# Altium schematic sheet Accelerometer.SchDoc: Accelerometer
size A; Author: Micheal Burin; Revision: 1.0; SheetNumber: 8; SheetTotal: 10
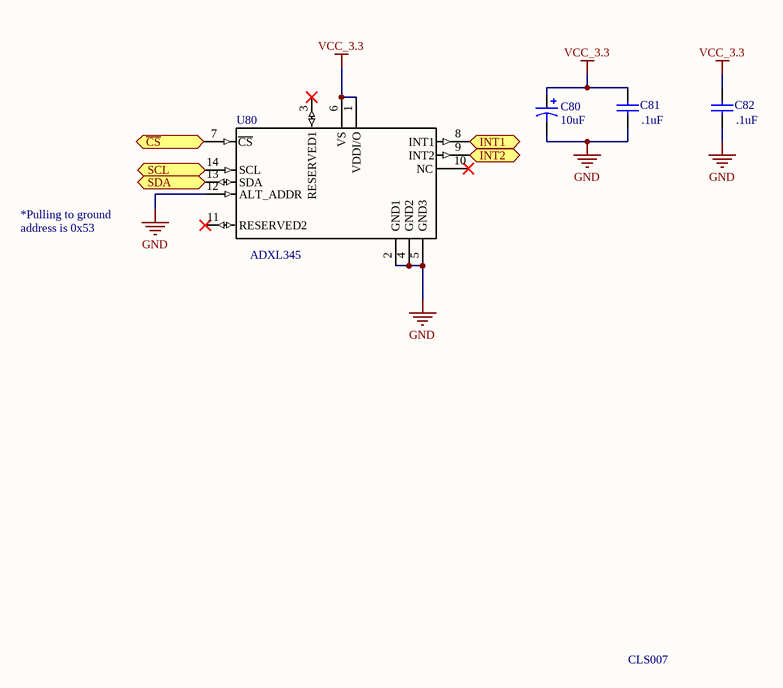
[diagram p0: Accelerometer.SchDoc]

## Parts
C80  value 10uF  [0805_CHIP_FP]  (hidden comment: Capacitor Polarized)
C81  value .1uF  [0805_CHIP_FP]  (hidden comment: Capacitor_unpolarized_0805)
C82  value .1uF  [0805_CHIP_FP]  (hidden comment: Capacitor_unpolarized_0805)
U80  MOTION/POSITION-ADXL345BCCZ-RL(14P-5.0X3.0MM)  [ADI-CC-14-1_V]  (value not drawn)

## Ports
INT1 (out), INT2 (out), SCL (in), SDA (bidir), ~{CS} (in)

## Nets
GND: C80.2 C81.1 C82.1 U80.2(GND1) U80.4(GND2) U80.5(GND3) U80.12(ALT_ADDR)
VCC_3.3: C80.1 C81.2 C82.2 U80.1(VDDI/O) U80.6(VS)
~{CS}: U80.7(~{CS}) ; port ~{CS}
INT1: U80.8(INT1) ; port INT1
INT2: U80.9(INT2) ; port INT2
SCL: U80.14(SCL) ; port SCL
SDA: U80.13(SDA) ; port SDA

Not connected (* = marked no-connect by the designer): U80 3(RESERVED1)* 10(NC)* 11(RESERVED2)*

## Notes on the sheet
- *Pulling to ground
- address is 0x53
- (near U80) ADXL345
- CLS007

## Library data of the parts
C80 = Capacitor Polarized: Manufacturer: AVX Corporation; Manufacturer Part Number: TLJR106M010R3000; Vendor Part Number: 478-3346-1-ND; Vendor: Digikey; Vendor Description: CAP TANT 10UF 10V 20% 0805; ComponentLink1Description: Datasheet; ComponentLink1URL: https://www.digikey.com/product-detail/en/avx-corporation/TLJR106M010R3000/478-3346-1-ND/930138; Cost: .57
C81 C82 = Capacitor_unpolarized_0805: Manufacturer: Johanson Dielectrics Inc.; Manufacturer Part Number: 250R15W104KV4T; Vendor Part Number: 709-1185-1-ND; Vendor: Digikey; Vendor Description: CAP CER 0.1UF 25V X7R 0805; ComponentLink1Description: Datasheet; ComponentLink1URL: https://www.digikey.com/product-detail/en/johanson-dielectrics-inc/250R15W104KV4T/709-1185-1-ND/1859517; Cost: .18
U80 = MOTION/POSITION-ADXL345BCCZ-RL(14P-5.0X3.0MM): Accelerometer Triple Â±2/Â±4/Â±8/Â±16g 2V to 3.6V 14-Pin LGA T/R; Manufacturer: Analog Devices Inc.; Vendor Part Number: ADXL345BCCZ-RLCT-ND; Vendor: Digikey; Vendor Description: ACCEL 2-16G I2C/SPI 14LGA; Value: *; ComponentLink1Description: Datasheet; Cost: 4.95; Manufacturer Part Number: ADXL345BCCZ-RL; ComponentLink1URL: https://www.digikey.com/product-detail/en/analog-devices-inc/ADXL345BCCZ-RL/ADXL345BCCZ-RLCT-ND/2237841